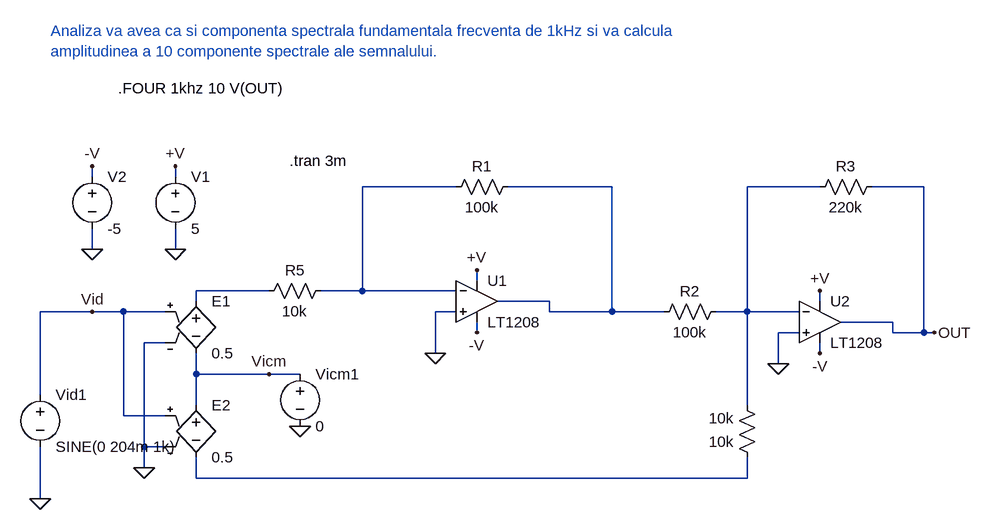
[diagram p0: schematic ETAJ1 ANALIZA TRANS THD.asc]
ETAJ1 ANALIZA TRANS THD.asc, the LTspice schematic file:
Version 4
SHEET 1 880 680
WIRE -640 -96 -640 -112
WIRE -512 -96 -512 -112
WIRE -80 -80 -224 -80
WIRE 160 -80 0 -80
WIRE 480 -80 368 -80
WIRE 640 -80 560 -80
WIRE -640 16 -640 -16
WIRE -512 16 -512 -16
WIRE -48 64 -48 48
WIRE -368 80 -480 80
WIRE -224 80 -224 -80
WIRE -224 80 -288 80
WIRE -80 80 -224 80
WIRE -480 96 -480 80
WIRE 64 96 -16 96
WIRE 480 96 480 80
WIRE -640 112 -720 112
WIRE -592 112 -640 112
WIRE -528 112 -592 112
WIRE -80 112 -112 112
WIRE 64 112 64 96
WIRE 160 112 160 -80
WIRE 160 112 64 112
WIRE 240 112 160 112
WIRE 368 112 368 -80
WIRE 368 112 320 112
WIRE 448 112 368 112
WIRE 592 128 512 128
WIRE -48 144 -48 128
WIRE 448 144 416 144
WIRE 592 144 592 128
WIRE 640 144 640 -80
WIRE 640 144 592 144
WIRE 656 144 640 144
WIRE -528 160 -560 160
WIRE -112 176 -112 112
WIRE 480 176 480 160
WIRE 416 192 416 144
WIRE -480 208 -480 176
WIRE -368 208 -480 208
WIRE -320 208 -368 208
WIRE -720 240 -720 112
WIRE -480 256 -480 208
WIRE 368 256 368 112
WIRE -592 272 -592 112
WIRE -528 272 -592 272
WIRE -560 320 -560 160
WIRE -528 320 -560 320
WIRE -560 352 -560 320
WIRE -480 368 -480 336
WIRE 368 368 368 336
WIRE 368 368 -480 368
WIRE -720 400 -720 320
FLAG -48 48 +V
FLAG -48 144 -V
FLAG 480 80 +V
FLAG 480 176 -V
FLAG 656 144 OUT
FLAG -112 176 0
FLAG 416 192 0
FLAG -720 400 0
FLAG -560 352 0
FLAG -320 288 0
FLAG -640 112 Vid
FLAG -368 208 Vicm
FLAG -512 16 0
FLAG -512 -112 +V
FLAG -640 16 0
FLAG -640 -112 -V
SYMBOL res 16 -96 R90
WINDOW 0 0 56 VBottom 2
WINDOW 3 32 56 VTop 2
SYMATTR InstName R1
SYMATTR Value 100k
SYMBOL res 336 96 R90
WINDOW 0 0 56 VBottom 2
WINDOW 3 32 56 VTop 2
SYMATTR InstName R2
SYMATTR Value 100k
SYMBOL res 576 -96 R90
WINDOW 0 0 56 VBottom 2
WINDOW 3 32 56 VTop 2
SYMATTR InstName R3
SYMATTR Value 220k
SYMBOL res 384 352 R180
WINDOW 0 36 76 Left 2
WINDOW 3 36 40 Left 2
SYMATTR InstName 10k
SYMATTR Value 10k
SYMBOL e -480 80 R0
SYMATTR InstName E1
SYMATTR Value 0.5
SYMBOL e -480 240 R0
SYMATTR InstName E2
SYMATTR Value 0.5
SYMBOL voltage -320 192 R0
WINDOW 123 0 0 Left 0
WINDOW 39 0 0 Left 0
SYMATTR InstName Vicm1
SYMATTR Value 0
SYMBOL voltage -512 -112 R0
WINDOW 123 0 0 Left 2
WINDOW 39 0 0 Left 2
SYMATTR InstName V1
SYMATTR Value 5
SYMBOL voltage -640 -112 R0
WINDOW 123 0 0 Left 2
WINDOW 39 0 0 Left 2
SYMATTR InstName V2
SYMATTR Value -5
SYMBOL res -272 64 R90
WINDOW 0 0 56 VBottom 2
WINDOW 3 32 56 VTop 2
SYMATTR InstName R5
SYMATTR Value 10k
SYMBOL OpAmps\\LT1208 -48 32 R0
SYMATTR InstName U1
SYMBOL OpAmps\\LT1208 480 64 R0
SYMATTR InstName U2
SYMBOL voltage -720 224 R0
WINDOW 123 0 0 Left 0
WINDOW 39 0 0 Left 0
SYMATTR InstName Vid1
SYMATTR Value SINE(0 204m 1k)
TEXT -336 -120 Left 2 !.tran 3m
TEXT -600 -232 Left 2 !.FOUR 1khz 10 V(OUT)
TEXT -704 -320 Left 2 ;Analiza va avea ca si componenta spectrala fundamentala frecventa de 1kHz si va calcula \namplitudinea a 10 componente spectrale ale semnalului.

The netlist it stands for:
* ETAJ1 ANALIZA TRANS THD.asc
R1 N002 N001 100k
R2 N003 N002 100k
R3 OUT N003 220k
R§10k N005 N003 10k
E1 N004 Vicm Vid 0 0.5
E2 Vicm N005 Vid 0 0.5
Vicm1 Vicm 0 0
V1 +V 0 5
V2 -V 0 -5
R5 N001 N004 10k
XU1 0 N001 +V -V N002 LT1208  ; pins In+ In- V+ V- OUT
XU2 0 N003 +V -V OUT LT1208  ; pins In+ In- V+ V- OUT
Vid1 Vid 0 SINE(0 204m 1k)
.tran 3m
.FOUR 1khz 10 V(OUT)
* Analiza va avea ca si componenta spectrala fundamentala frecventa de 1kHz si va calcula
* amplitudinea a 10 componente spectrale ale semnalului.
.backanno
.end